# Altium schematic sheet PCIe Cell Modem.SchDoc: Yonder Parent TS-4900 Version
size Letter; DrawnBy: MTAN; Organization: Altium Limited; DocumentNumber: 2; Revision: D; SheetNumber: 2; SheetTotal: 5
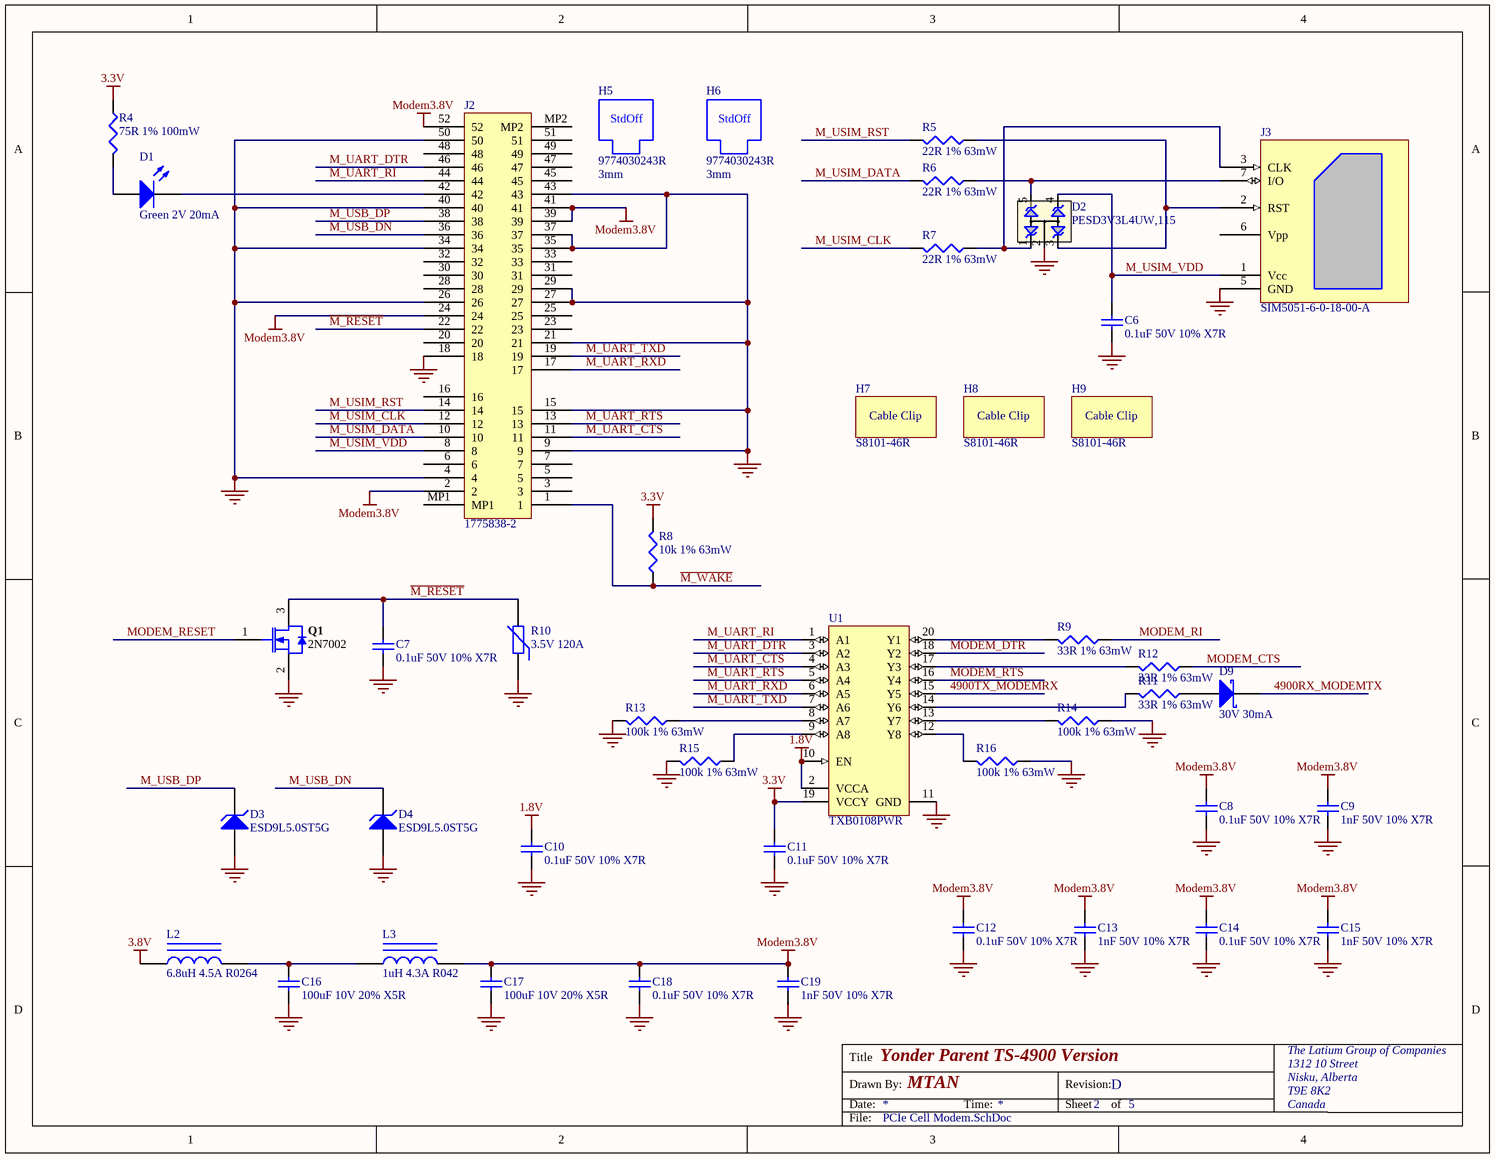
[diagram p0: PCIe Cell Modem.SchDoc]

## Parts
C6  0.1uF 50V 10% X7R  [CAPC1005L]
C7  0.1uF 50V 10% X7R  [CAPC1005L]
C8  0.1uF 50V 10% X7R  [CAPC1005L]
C9  1nF 50V 10% X7R  [CAPC1005L]
C10  0.1uF 50V 10% X7R  [CAPC1005L]
C11  0.1uF 50V 10% X7R  [CAPC1005L]
C12  0.1uF 50V 10% X7R  [CAPC1005L]
C13  1nF 50V 10% X7R  [CAPC1005L]
C14  0.1uF 50V 10% X7R  [CAPC1005L]
C15  1nF 50V 10% X7R  [CAPC1005L]
C16  100uF 10V 20% X5R  [C1210_L]
C17  100uF 10V 20% X5R  [C1210_L]
C18  0.1uF 50V 10% X7R  [CAPC1005L]
C19  1nF 50V 10% X7R  [CAPC1005L]
D1  Green 2V 20mA  [CD1608-0603]
D2  PESD3V3L4UW,115  [SOT-665]
D3  ESD9L5.0ST5G  [SOD-923]
D4  ESD9L5.0ST5G  [SOD-923]
D9  30V 30mA  [CD1310-0504]
H5  9774030243R  Height: 3mm  [Wurth 9774030243R]
H6  9774030243R  Height: 3mm  [Wurth 9774030243R]
H7  S8101-46R  [Coax Cable Clip]
H8  S8101-46R  [Coax Cable Clip]
H9  S8101-46R  [Coax Cable Clip]
J2  1775838-2  [TE 1775838-2]
J3  SIM5051-6-0-18-00-A  [SIM5051-6]
L2  6.8uH 4.5A R0264  [1267AY]
L3  1uH 4.3A R042  [WE-LQS 252012]
Q1  2N7002  [INF-PG-SOT23_L]
R4  75R 1% 100mW  [RESC1608L]
R5  22R 1% 63mW  [RESC1005L]
R6  22R 1% 63mW  [RESC1005L]
R7  22R 1% 63mW  [RESC1005L]
R8  10k 1% 63mW  [RESC1005L]
R9  33R 1% 63mW  [RESC1005L]
R10  3.5V 120A  [6-0805_L]
R11  33R 1% 63mW  [RESC1005L]
R12  33R 1% 63mW  [RESC1005L]
R13  100k 1% 63mW  [RESC1005L]
R14  100k 1% 63mW  [RESC1005L]
R15  100k 1% 63mW  [RESC1005L]
R16  100k 1% 63mW  [RESC1005L]
U1  TXB0108PWR  [TSSOP20_L]

## Nets
1.8V: C10.1 U1.2(VCCA) U1.10(EN)
3.3V: C11.1 R4.1 R8.2 U1.19(VCCY)
3.8V: L2.1
GND: C6.2 C7.2 C8.2 C9.2 C10.2 C11.2 C12.2 C13.2 C14.2 C15.2 C16.1 C17.1 C18.2 C19.2 D2.2(A1) D3.1(A) D4.1(A) J2.4 J2.9 J2.15 J2.18 J2.21 J2.26 J2.27 J2.29 J2.34 J2.35 J2.37 J2.40 J2.43 J2.50 J3.5(GND) Q1.2(SOURCE) R10.1 R13.2 R14.1 R15.2 R16.1 U1.11(GND)
Modem3.8V: C8.1 C9.1 C12.1 C13.1 C14.1 C15.1 C17.2 C18.1 C19.1 J2.2 J2.24 J2.39 J2.41 J2.52 L3.2
4900RX_MODEMTX: D9.2(K)
4900TX_MODEMRX: U1.15(Y5)
~{M_RESET}: C7.1 J2.22 Q1.3(DRAIN) R10.2
~{M_WAKE}: J2.1 R8.1
M_UART_CTS: J2.11 U1.4(A3)
M_UART_DTR: J2.46 U1.3(A2)
M_UART_RI: J2.44 U1.1(A1)
M_UART_RTS: J2.13 U1.5(A4)
M_UART_RXD: J2.17 U1.6(A5)
M_UART_TXD: J2.19 U1.7(A6)
M_USB_DN: D4.2(K) J2.36
M_USB_DP: D3.2(K) J2.38
M_USIM_CLK: J2.12 R7.2
M_USIM_DATA: J2.10 R6.2
M_USIM_RST: J2.14 R5.2
M_USIM_VDD: C6.1 D2.4(C3) J2.8 J3.1(Vcc)
MODEM_CTS: R12.1
MODEM_DTR: U1.18(Y2)
MODEM_RESET: Q1.1(GATE)
MODEM_RI: R9.1
MODEM_RTS: U1.16(Y4)
NetC16_2: C16.2 L2.2 L3.1
NetD1_1: D1.1(A) R4.2
NetD1_2: D1.2(K) J2.42
NetD2_1: D2.1(C1) J3.3(CLK) R7.1
NetD2_3: D2.3(C2) J3.2(RST) R5.1
NetD2_5: D2.5(C4) J3.7(I/O) R6.1
NetD9_1: D9.1(A) R11.1
NetR9_2: R9.2 U1.20(Y1)
NetR11_2: R11.2 U1.14(Y6)
NetR12_2: R12.2 U1.17(Y3)
NetR13_1: R13.1 U1.8(A7)
NetR14_2: R14.2 U1.13(Y7)
NetR15_1: R15.1 U1.9(A8)
NetR16_2: R16.2 U1.12(Y8)

Not connected (* = marked no-connect by the designer): J2 3 5 6 7 16 20 23 25 28 30 31 32 33 45 47 48 49 51 MP1 MP2; J3 6(Vpp)

## Notes on the sheet
- Title
- Drawn By:
- Date:
- Time:
- Revision:
- Sheet
- of
- The Latium Group of Companies
- 1312 10 Street
- Nisku, Alberta
- T9E 8K2
- Canada
- File:
- (in symbol SMD M3 Spacer) StdOff

## Library data of the parts
C6-C19 = Cap: Capacitor
  C6-C8 C10-C12 C14 C18: Value: 0.1uF 50V 10% X7R
  C9 C13 C15 C19: Value: 1nF 50V 10% X7R
  C16 C17: Value: 100uF 10V 20% X5R
D1 = LED2: LED GREEN CLEAR 0603 SMD; Manufacturer: Wurth Electronics Inc; Manufacturer Part Number: 150060VS75000; Value: Green 2V 20mA; Supplier 1: Digi-Key; Supplier 1 Part Number: 732-4980-1-ND
D2 = 82402374: TVS DIODE 3.3V 12V SOT665; Manufacturer: Nexperia USA Inc; Value: PESD3V3L4UW,115; Manufacturer Part Number: PESD3V3L4UW,115; Supplier 1: Digi-Key; Supplier 1 Part Number: 1727-5790-1-ND; ComponentLink1Description: Data Sheet; ComponentLink1URL: S:\Hardware\Data Sheets\Passive\TVS\PESDXL4UF_G_W.pdf
D3 D4 = D Zener: TVS DIODE 5V 9.8V SOD923; Manufacturer: ON Semiconductor; Value: ESD9L5.0ST5G; Manufacturer Part Number: ESD9L5.0ST5G; Supplier 1: Digi-Key; Supplier 1 Part Number: ESD9L5.0ST5GOSCT-ND
D9 = D Schottky: DIODE SCHOTTKY 30V 30MA SOD523; Manufacturer: ON Semiconductor; Manufacturer Part Number: RB751S40T1G; Value: 30V 30mA; Supplier 1: Digi-Key; Supplier 1 Part Number: RB751S40T1GOSCT-ND
H5 H6 = SMD M3 Spacer: ROUND STANDOFF M2X0.4 STEEL 3MM; Manufacturer: Wurth Electronics Inc; Supplier 1: Digi-Key; Value: 9774030243R; Manufacturer Part Number: 9774030243R; ComponentLink1Description: Drawing; ComponentLink1URL: S:\Hardware\Data Sheets\Passive\Standoffs\Wurth 9774070360R.pdf; Supplier 1 Part Number: 732-7085-1-ND
H7-H9 = Cable Clip: CBL CLIP C-TYPE SILVER SOLDER; Manufacturer: Harwin Inc; Value: S8101-46R; ComponentLink1Description: Drawing; ComponentLink1URL: S:\Hardware\Data Sheets\Passive\Strain Reliefs\S8101R.pdf; Manufacturer Part Number: S8101-46R; Supplier 1: Digi-Key; Supplier 1 Part Number: 952-1576-1-ND
J2 = TE1775838-2: CONN PCI EXP MINI FEMALE 52POS; Manufacturer: TE Connectivity AMP Connectors; Value: 1775838-2; Manufacturer Part Number: 1775838-2; ComponentLink1Description: Data Sheet; ComponentLink1URL: S:\Hardware\Data Sheets\Passive\Connectors\TE Mini PCIe 52 Pin Connector.pdf; Supplier 1: Digi-Key; Supplier 1 Part Number: A123340CT-ND; ComponentLink2Description: SIM7600 PCIe HW Design Guide; ComponentLink2URL: S:\Hardware\Data Sheets\Active\Modems\SIM7600 PCIe Hardware Design Guide.pdf
J3 = Mini SIM 6pos Conn: MINI SIM HINGED, 6P, SMT, 1.8MM; Manufacturer: GCT; Value: SIM5051-6-0-18-00-A; Manufacturer Part Number: SIM5051-6-0-18-00-A; Supplier 1: Digi-Key; Supplier 1 Part Number: 2073-SIM5051-6-0-18-00-ACT-ND; ComponentLink1Description: Data Sheet; ComponentLink1URL: S:\Hardware\Data Sheets\Passive\Connectors\sim5051.pdf
L2 = Inductor Iron: 6.8µH Shielded Fixed Inductor; Manufacturer Part Number: 1267AY-6R8N=P3; Manufacturer: Murata Electronics; Value: 6.8uH 4.5A R0264; Supplier 1: Digi-Key; Supplier 1 Part Number: 490-14066-1-ND
L3 = Inductor Iron: FIXED IND 1UH 4.3A 42 MOHM SMD; Manufacturer Part Number: DFE252012P-1R0M=P2; Manufacturer: Murata Electronics; Value: 1uH 4.3A R042; Supplier 1: Digi-Key; Supplier 1 Part Number: 490-10647-1-ND
Q1 = 2N7002: MOSFET N-CH 60V 115MA SOT-23; Manufacturer: ON Semiconductor; PartNumber: 2N7002; ComponentLink1Description: Data Sheet; ComponentLink1URL: S:\Hardware\Data Sheets\Active\Transistors\FETs\NDS7002A-D.pdf; Manufacturer Part Number: 2N7002; Value: 2N7002; Supplier 1: Digi-Key; Supplier 1 Part Number: 2N7002NCT-ND
R4-R9 R11-R16 = Res3: Resistor
  R4: Value: 75R 1% 100mW
  R5-R7: Value: 22R 1% 63mW
  R8: Value: 10k 1% 63mW
  R9 R11 R12: Value: 33R 1% 63mW
  R13-R16: Value: 100k 1% 63mW
R10 = Res Varistor: VARISTOR 5.35V 120A 0805; Manufacturer: Littelfuse Inc; Manufacturer Part Number: V3.5MLA0805H; Value: 3.5V 120A; Supplier 1: Digi-Key; Supplier 1 Part Number: F2206CT-ND
U1 = ADG3300BRUZ: IC TRNSLTR BIDIRECTIONAL 20TSSOP; Manufacturer: Texas Instruments; Value: TXB0108PWR; Manufacturer Part Number: TXB0108PWR; Supplier 1: Digi-Key; Supplier 1 Part Number: 296-21527-1-ND; ComponentLink1Description: Data Sheet; ComponentLink1URL: S:\Hardware\Data Sheets\Active\Logic\txb0108.pdf